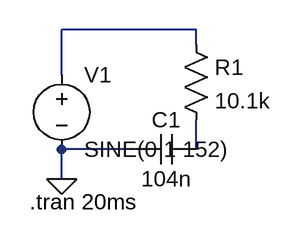
[diagram p0: schematic Draft2.asc]
Draft2.asc, the LTspice schematic file:
Version 4
SHEET 1 880 680
WIRE 288 80 144 80
WIRE 288 96 288 80
WIRE 144 128 144 80
WIRE 224 208 144 208
WIRE 288 208 288 176
WIRE 144 240 144 208
FLAG 144 240 0
SYMBOL voltage 144 112 R0
WINDOW 123 0 0 Left 2
WINDOW 39 0 0 Left 2
SYMATTR InstName V1
SYMATTR Value SINE(0 1 152)
SYMBOL res 272 80 R0
SYMATTR InstName R1
SYMATTR Value 10.1k
SYMBOL cap 288 192 R90
WINDOW 0 0 32 VBottom 2
WINDOW 3 32 32 VTop 2
SYMATTR InstName C1
SYMATTR Value 104n
TEXT 110 264 Left 2 !.tran 20ms

The netlist it stands for:
* Draft2.asc
V1 N001 0 SINE(0 1 152)
R1 N001 N002 10.1k
C1 N002 0 104n
.tran 20ms
.backanno
.end